# EAGLE design Blinky_v1 (EAGLE 7.6.0)
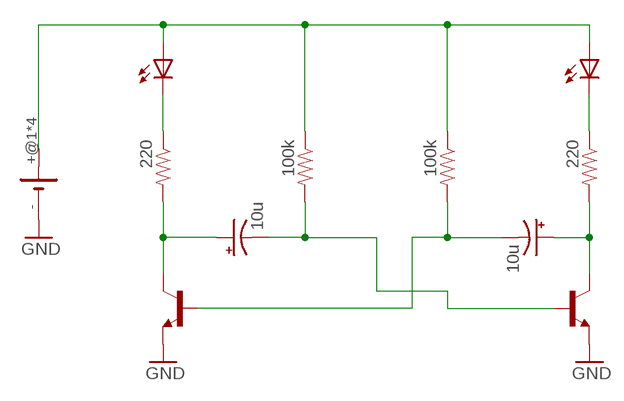
[diagram p0: schematic, sheet 1]

## Parts
BT1  BAT-HLD-001-THM  [LINX_BAT-HLD-001-THM]
C1  10u  CAP_POLPTH2  [CPOL-RADIAL-10UF-25V]
C2  10u  CAP_POLPTH2  [CPOL-RADIAL-10UF-25V]
LED1  RED  LED5MM  [LED5MM]
LED2  RED  LED5MM  [LED5MM]
R1  220  RESISTORAXIAL-0.3  [AXIAL-0.3]
R2  220  RESISTORAXIAL-0.3  [AXIAL-0.3]
R3  100k  RESISTORAXIAL-0.3  [AXIAL-0.3]
R4  100k  RESISTORAXIAL-0.3  [AXIAL-0.3]
U$1  TRANSISTOR_NPN_2PTH  [TO-92]
U$2  TRANSISTOR_NPN_2PTH  [TO-92]

## Nets
GND: BT1.- U$1.3(E) U$2.3(E)
N$1: LED2.K(C) R2.P$1
N$2: C2.1(+) R2.P$2 U$2.1(C)
N$3: LED1.K(C) R1.P$1
N$4: C1.1(+) R1.P$2 U$1.1(C)
N$5: BT1.+@1(+) BT1.+@2(+) BT1.+@3(+) BT1.+@4(+) LED1.A LED2.A R3.P$1 R4.P$1
N$6: C1.2(-) R3.P$2 U$2.2(B)
N$7: C2.2(-) R4.P$2 U$1.2(B)

## Library data of the parts
BT1 = BAT-HLD-001-THM:BAT-HLD-001-THM: Battery Holder CR2025/2032 Through Hole Mount; COST1000: 0.196; COST1000_B: 0.184; LINK: http://www.mouser.com/ProductDetail/Linx-Technologies/BAT-HLD-001-THM/; LINK_B: http://www.mouser.com/ProductDetail/Panasonic-Battery/CR2016/
C1 = SparkFun-Passives:CAP_POL: Capacitor Polarized These are standard SMD and PTH capacitors. Normally 10uF, 47uF, and 100uF in electrolytic and tantalum varieties. Always verify the external diameter of the through hole cap, it varies with capacity, voltage, and manufacturer. The EIA devices should be standard.; COST1000: 0.048; LINK: http://www.mouser.com/ProductDetail/Nichicon/USA1C100MDD/
C2 = SparkFun-Passives:CAP_POL: Capacitor Polarized These are standard SMD and PTH capacitors. Normally 10uF, 47uF, and 100uF in electrolytic and tantalum varieties. Always verify the external diameter of the through hole cap, it varies with capacity, voltage, and manufacturer. The EIA devices should be standard.
LED1 LED2 = led:LED: LED OSRAM: - CHIPLED LG R971, LG N971, LY N971, LG Q971, LY Q971, LO R971, LY R971 LH N974, LH R974 LS Q976, LO Q976, LY Q976 LO Q996 - Hyper CHIPLED LW Q18S LB Q993, LB Q99A, LB R99A - SideLED LS A670, LO A670, LY A670, LG A670, LP A670 LB A673, LV A673, LT A673, LW A673 LH A674 LY A675 LS A676, LA A676, LO A676, LY A676, LW A676 LS A679, LY A679, LG A679 - Hyper Micro SIDELED® LS Y876, LA Y876, LO Y876, LY Y876 LT Y87S - SmartLED LW L88C, LW L88S LB L89C, LB L89S, LG L890 LS L89K, LO L89K, LY L89K LS L896, LA L896, LO L896, LY L896 - TOPLED LS T670, LO T670, LY T670, LG T670, LP T670 LSG T670, LSP T670, LSY T670, LOP T670, LYG T670 LG T671, LOG T671, LSG T671 LB T673, LV T673, LT T673, LW T673 LH T674 LS T676, LA T676, LO T676, LY T676, LB T676, LH T676, LSB T676, LW T676 LB T67C, LV T67C, LT T67C, LS T67K, LO T67K, LY T67K, LW E67C LS E67B, LA E67B, LO E67B, LY E67B, LB E67C, LV E67C, LT E67C LW T67C LS T679, LY T679, LG T679 LS T770, LO T770, LY T770, LG T770, LP T770 LB T773, LV T773, LT T773, LW T773 LH T774 LS E675, LA E675, LY E675, LS T675 LS T776, LA T776, LO T776, LY T776, LB T776 LHGB T686 LT T68C, LB T68C - Hyper Mini TOPLED® LB M676 - Mini TOPLED Santana® LG M470 LS M47K, LO M47K, LY M47K Source: http://www.osram.convergy.de LUXEON: - LUMILED® LXK2-PW12-R00, LXK2-PW12-S00, LXK2-PW14-U00, LXK2-PW14-V00 LXK2-PM12-R00, LXK2-PM12-S00, LXK2-PM14-U00 LXK2-PE12-Q00, LXK2-PE12-R00, LXK2-PE12-S00, LXK2-PE14-T00, LXK2-PE14-U00 LXK2-PB12-K00, LXK2-PB12-L00, LXK2-PB12-M00, LXK2-PB14-N00, LXK2-PB14-P00, LXK2-PB14-Q00 LXK2-PR12-L00, LXK2-PR12-M00, LXK2-PR14-Q00, LXK2-PR14-R00 LXK2-PD12-Q00, LXK2-PD12-R00, LXK2-PD12-S00 LXK2-PH12-R00, LXK2-PH12-S00 LXK2-PL12-P00, LXK2-PL12-Q00, LXK2-PL12-R00 Source: www.luxeon.com KINGBRIGHT: KA-3528ASYC Source: www.kingbright.com; COST1000: 0.038; LINK: http://www.mouser.com/ProductDetail/Lumex/SLX-LX5093ID/
R1 = SparkFun-Passives:RESISTOR: Resistor Basic schematic elements and footprints for 0603, 1206, and PTH resistors.; COST1000: 0.009; LINK: http://www.mouser.com/ProductDetail/Yageo/CFR-25JR-52-220R/
R2 R4 = SparkFun-Passives:RESISTOR: Resistor Basic schematic elements and footprints for 0603, 1206, and PTH resistors.
R3 = SparkFun-Passives:RESISTOR: Resistor Basic schematic elements and footprints for 0603, 1206, and PTH resistors.; COST1000: 0.015; LINK: http://www.mouser.com/ProductDetail/Yageo/MFR-25FRF52-100K/
U$1 = SparkFun-DiscreteSemi:TRANSISTOR_NPN_2: Alternate TO-92 NPN BJT; COST1000: 0.039; LINK: http://www.mouser.com/ProductDetail/Fairchild-Semiconductor/PN2222ATF/
U$2 = SparkFun-DiscreteSemi:TRANSISTOR_NPN_2: Alternate TO-92 NPN BJT

## Board
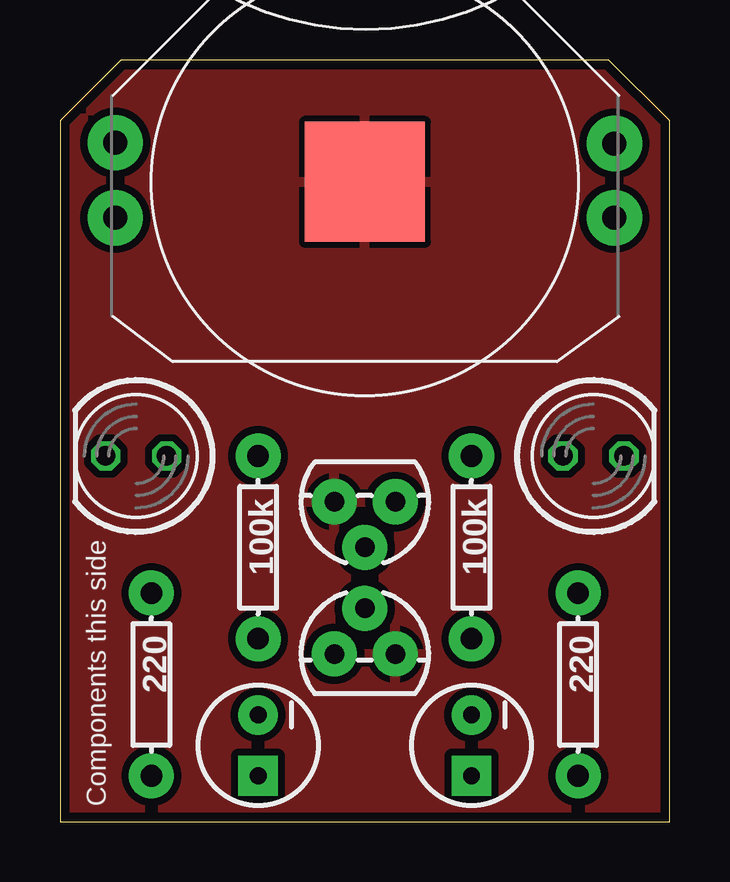
[diagram p1: board, top side]
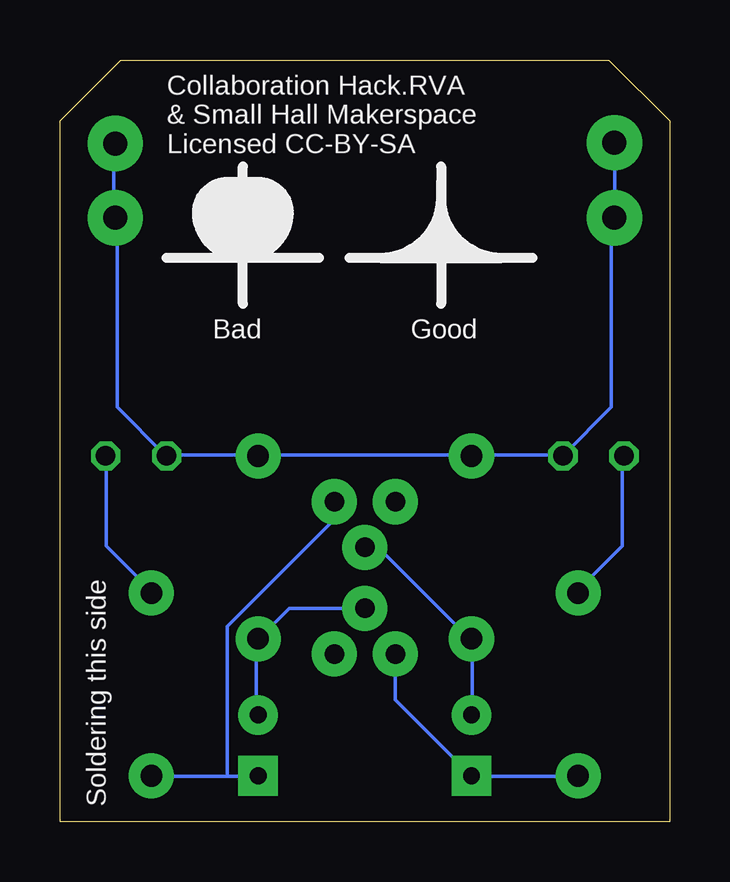
[diagram p2: board, bottom side, seen from below]

Size 25.4 x 31.75 mm. Coordinates in mm from the lower left corner, seen from the top.
Outline: 0,0 25.4,0 25.4,29.21 22.86,31.75 2.54,31.75 0,29.21 0,0
Copper layers (1*16): Top 0.0356mm / dielectric 1.5011mm / Bottom 0.0356mm
Design rules "LaenPCBOrder": minimum track width 6mil, minimum drill 13mil, track to track 6mil, track to pad 6mil, pad to pad 6mil, via to via 6mil, smd to smd 6mil, copper to edge 15mil, drill to drill 6mil, minimum pad ring 7mil, minimum via ring 7mil, stop-mask expansion 3mil, vias tented up to drill 0mil, thermal gap 10mil

### Footprints (pad centres in the part's own frame; a part is rotated, then mirrored left to right if it is on the bottom)
LINX_BAT-HLD-001-THM = drill 1 pad 2.3: +@1 -10.4,1.5; +@2 -10.4,-1.6; +@3 10.4,1.5; +@4 10.4,-1.627 | smd 5 x 5: - 0,0
CPOL-RADIAL-10UF-25V = drill 0.7 pad 1.651 square: 1 1.27,0 | drill 0.7 pad 1.651: 2 -1.27,0
LED5MM = drill 0.813 octagon: A -1.27,0; K 1.27,0
AXIAL-0.3 = drill 0.9 pad 1.88: P$1 -3.81,0; P$2 3.81,0
TO-92 = drill 0.813 pad 1.88: 1 -1.27,0; 2 0,1.905; 3 1.27,0

### Placement (x,y rotation side)
BT1  12.7,26.67 180 top
C1  8.26,3.18 270 top
C2  17.14,3.18 270 top
LED1  3.17,15.24 180 top
LED2  22.23,15.24 0 top
R1  3.81,5.71 270 top
R2  21.59,5.71 270 top
R3  8.26,11.43 270 top
R4  17.14,11.43 270 top
U$1  12.7,6.99 0 top
U$2  12.7,13.33 180 top

### Tracks (layer width: path | path; a pad name or v marks a point on that pad's centre or on a via)
GND
  pour Top (isolate 0.305): 0,0 0,29.21 2.54,31.75 22.86,31.75 25.4,29.21 25.4,0
N$1
  Bottom 0.152: LED2.K 23.47,15.14 23.47,11.48 21.64,9.65 R2.P$1
N$2
  Bottom 0.152: 18.44,1.88 21.49,1.88 R2.P$2 | 18.44,1.88 17.22,1.88 C2.1 | 18.44,1.88 18.44,8.13 14.02,12.55 14.02,13.31 U$2.1
N$3
  Bottom 0.152: LED1.K 1.98,15.14 1.98,11.48 3.81,9.65 R1.P$1
N$4
  Bottom 0.152: R1.P$2 3.81,1.88 8.23,1.88 C1.1 11.43,5.08 U$1.1
N$5
  Bottom 0.152: BT1.+@4 2.29,28.24 2.29,25.2 BT1.+@3 2.44,25.04 2.44,17.27 4.42,15.29 LED1.A 4.57,15.29 8.23,15.29 R3.P$1 8.38,15.29 17.07,15.29 R4.P$1 17.22,15.29 20.88,15.29 LED2.A 21.03,15.29 23.01,17.27 23.01,25.04 BT1.+@1 23.16,25.2 23.16,28.24 BT1.+@2
N$6
  Bottom 0.152: C1.2 8.23,4.47 8.23,7.52 R3.P$2 8.38,7.67 12.04,11.33 12.65,11.33 U$2.2
N$7
  Bottom 0.152: C2.2 17.22,4.47 17.22,7.52 R4.P$2 17.07,7.67 15.85,8.89 U$1.2

### Text on the board
tPlace: Components this side
bPlace: Collaboration Hack.RVA / & Small Hall Makerspace / Licensed CC-BY-SA | Good | Bad | Soldering this side